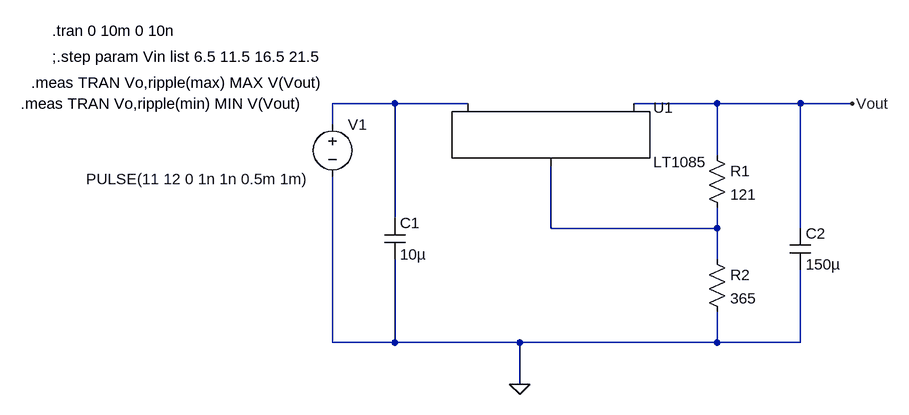
[diagram p0: schematic linear_reagulator_lt1085.asc]
linear_reagulator_lt1085.asc, the LTspice schematic file:
Version 4
SHEET 1 880 680
WIRE -32 112 -128 112
WIRE 80 112 -32 112
WIRE 464 112 336 112
WIRE 592 112 464 112
WIRE 672 112 592 112
WIRE -128 144 -128 112
WIRE 464 192 464 112
WIRE -32 288 -32 112
WIRE 208 304 208 208
WIRE 464 304 464 272
WIRE 464 304 208 304
WIRE 592 304 592 112
WIRE 464 352 464 304
WIRE -128 480 -128 224
WIRE -32 480 -32 352
WIRE -32 480 -128 480
WIRE 160 480 -32 480
WIRE 464 480 464 432
WIRE 464 480 160 480
WIRE 592 480 592 368
WIRE 592 480 464 480
WIRE 160 544 160 480
FLAG 672 112 Vout
FLAG 160 544 0
SYMBOL PowerProducts\\LT1085 208 112 R0
SYMATTR InstName U1
SYMBOL voltage -128 128 R0
WINDOW 3 -379 100 Left 2
WINDOW 123 0 0 Left 0
WINDOW 39 0 0 Left 0
SYMATTR InstName V1
SYMATTR Value PULSE(11 12 0 1n 1n 0.5m 1m)
SYMBOL res 448 176 R0
SYMATTR InstName R1
SYMATTR Value 121
SYMBOL res 448 336 R0
SYMATTR InstName R2
SYMATTR Value 365
SYMBOL cap -48 288 R0
SYMATTR InstName C1
SYMATTR Value 10µ
SYMBOL cap 576 304 R0
SYMATTR InstName C2
SYMATTR Value 150µ
TEXT -560 0 Left 2 !.tran 0 10m 0 10n
TEXT -560 40 Left 2 !;.step param Vin list 6.5 11.5 16.5 21.5
TEXT -592 80 Left 2 !.meas TRAN Vo,ripple(max) MAX V(Vout)
TEXT -608 112 Left 2 !.meas TRAN Vo,ripple(min) MIN V(Vout)

The netlist it stands for:
* linear_reagulator_lt1085.asc
XU1 N002 Vout N001 LT1085
V1 N001 0 PULSE(11 12 0 1n 1n 0.5m 1m)
R1 Vout N002 121
R2 N002 0 365
C1 N001 0 10µ
C2 Vout 0 150µ
.tran 0 10m 0 10n
;.step param Vin list 6.5 11.5 16.5 21.5
.meas TRAN Vo,ripple(max) MAX V(Vout)
.meas TRAN Vo,ripple(min) MIN V(Vout)
.backanno
.end